# EAGLE design ATTiny1614_Mainboard (EAGLE 7.7.0)
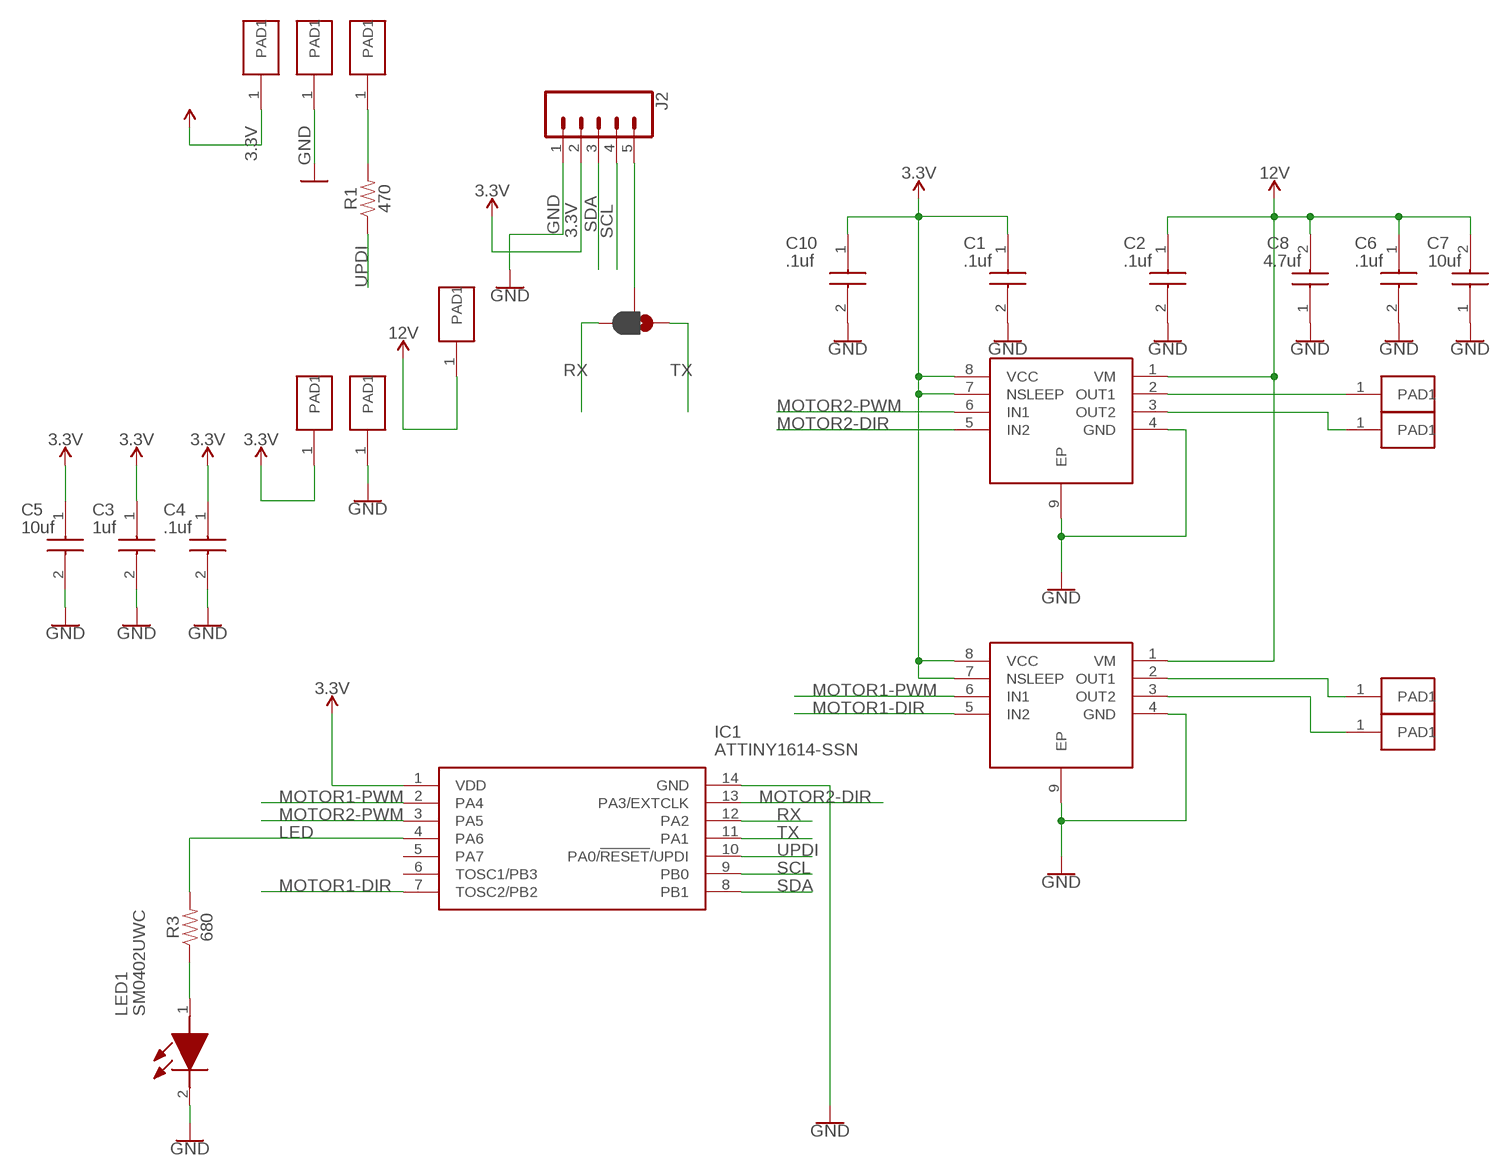
[diagram p0: schematic, sheet 1]

## Parts
C1  .1uf  0402-CAPCAPACITOR-0402  [CAPC1005X56N]
C2  .1uf  0402-CAPCAPACITOR-0402  [CAPC1005X56N]
C3  1uf  0402-CAPCAPACITOR-0402  [CAPC1005X56N]
C4  .1uf  0402-CAPCAPACITOR-0402  [CAPC1005X56N]
C5  10uf  0402-CAPCAPACITOR-0402  [CAPC1005X56N]
C6  .1uf  0402-CAPCAPACITOR-0402  [CAPC1005X56N]
C7  10uf  0402-CAPCAPACITOR-0402  [CAPC1005X56N]
C8  4.7uf  0402-CAPCAPACITOR-0402  [CAPC1005X56N]
C10  .1uf  0402-CAPCAPACITOR-0402  [CAPC1005X56N]
IC1  ATTINY1614-SSN  [SOIC127P600X175-14N]
IC2  DRV8837DSGR  [SON50P200X200X80-9N]
IC3  DRV8837DSGR  [SON50P200X200X80-9N]
J2  CONN_051.27MM  [1X05_1.27MM]
JP1  JUMPER-SMT_3_1-NC_PASTE_NO-SILK  [SMT-JUMPER_3_1-NC_PASTE_NO-SILK]
LED1  SM0402UWC  [SM0402UWC]
R1  470  470OHM-0402-1/16W-5%  [0402]
R3  680  470OHM-0402-1/16W-5%  [0402]
U$1  SINGLE_1.27MM_HOLE  [1.27MM_SINGLE_HOLE]
U$2  SINGLE_1.27MM_HOLE  [1.27MM_SINGLE_HOLE]
U$3  SINGLE_1.27MM_HOLE  [1.27MM_SINGLE_HOLE]
U$4  SINGLE_1.27MM_HOLE  [1.27MM_SINGLE_HOLE]
U$5  SINGLE_1.27MM_HOLE  [1.27MM_SINGLE_HOLE]
U$6  SINGLE_1.27MM_HOLE  [1.27MM_SINGLE_HOLE]
U$7  SINGLE_1.27MM_HOLE  [1.27MM_SINGLE_HOLE]
U$8  SINGLE_1.27MM_HOLE  [1.27MM_SINGLE_HOLE]
U$9  SINGLE_1.27MM_HOLE  [1.27MM_SINGLE_HOLE]
U$12  SINGLE_1.27MM_HOLE  [1.27MM_SINGLE_HOLE]

## Nets
3.3V: C1.1 C3.1 C4.1 C5.1 C10.1 IC1.1(VDD) IC2.7(NSLEEP) IC2.8(VCC) IC3.7(NSLEEP) IC3.8(VCC) J2.2 U$1.1(PAD1) U$4.1(PAD1)
12V: C2.1 C6.1 C7.2 C8.2 IC2.1(VM) IC3.1(VM) U$12.1(PAD1)
GND: C1.2 C2.2 C3.2 C4.2 C5.2 C6.2 C7.1 C8.1 C10.2 IC1.14(GND) IC2.4(GND) IC2.9(EP) IC3.4(GND) IC3.9(EP) J2.1 LED1.2(K) U$2.1(PAD1) U$3.1(PAD1)
LED: IC1.4(PA6) R3.2
MOTOR1-DIR: IC1.7(TOSC2/PB2) IC2.5(IN2)
MOTOR1-PWM: IC1.2(PA4) IC2.6(IN1)
MOTOR2-DIR: IC1.13(PA3/EXTCLK) IC3.5(IN2)
MOTOR2-PWM: IC1.3(PA5) IC3.6(IN1)
N$1: IC2.2(OUT1) U$8.1(PAD1)
N$2: IC2.3(OUT2) U$9.1(PAD1)
N$3: IC3.2(OUT1) U$6.1(PAD1)
N$4: IC3.3(OUT2) U$7.1(PAD1)
N$6: LED1.1(A) R3.1
N$7: J2.5 JP1.2
N$8: R1.2 U$5.1(PAD1)
RX: IC1.12(PA2) JP1.3
SCL: IC1.9(PB0) J2.4
SDA: IC1.8(PB1) J2.3
TX: IC1.11(PA1) JP1.1
UPDI: IC1.10(PA0/!RESET!/UPDI) R1.1
Unconnected: IC1.5(PA7) IC1.6(TOSC1/PB3)

## Library data of the parts
C1-C8 C10 = CJz_Master_Eaglez_Library:0402-CAP: Multilayer Ceramic Capacitors MLCC - SMD/SMT 6.3V 1uF X7R 0402 10% Tol Source: Datasheet; DESCRIPTION: Multilayer Ceramic Capacitors MLCC - SMD/SMT 6.3V 1uF X7R 0402 10% Tol; HEIGHT: 0.56mm; MANUFACTURER_NAME: AVX; MANUFACTURER_PART_NUMBER: 04026C105KAT2A; MOUSER_PART_NUMBER: 581-04026C105KAT2A; MOUSER_PRICE-STOCK: https://www.mouser.co.uk/ProductDetail/AVX/04026C105KAT2A?qs=vNaUhps%252BC9%252B%252BBkS0SDtwiQ%3D%3D
IC1 = ATTINY1614-SSN:ATTINY1614-SSN: 8-bit Microcontrollers - MCU 20MHz, SOIC, 85C, Green Source: Datasheet <https://4donline.ihs.com/images/VipMasterIC/IC/MCHP/MCHP-S-A0003038535/MCHP-S-A0003038535-1.pdf?hkey=6D3A4C79FDBF58556ACFDE234799DDF0>; DESCRIPTION: 8-bit Microcontrollers - MCU 20MHz, SOIC, 85C, Green; HEIGHT: 1.75mm; MANUFACTURER_NAME: Microchip; MANUFACTURER_PART_NUMBER: ATTINY1614-SSN; MOUSER_PART_NUMBER: 556-ATTINY1614-SSN; MOUSER_PRICE-STOCK: https://www.mouser.co.uk/ProductDetail/Microchip-Technology-Atmel/ATTINY1614-SSN?qs=T3oQrply3y%2FF20EnX%252BXRaw%3D%3D
IC2 IC3 = DRV8837DSGR:DRV8837DSGR: 1.8A Low Voltage Brushed DC Motor Driver (PWM Ctrl) Source: Datasheet <http://www.ti.com/lit/gpn/drv8837>; DESCRIPTION: 1.8A Low Voltage Brushed DC Motor Driver (PWM Ctrl); HEIGHT: 0.8mm; MANUFACTURER_NAME: Texas Instruments; MANUFACTURER_PART_NUMBER: DRV8837DSGR; MOUSER_PART_NUMBER: 595-DRV8837DSGR; MOUSER_PRICE-STOCK: https://www.mouser.co.uk/ProductDetail/Texas-Instruments/DRV8837DSGR?qs=l6ZoeTYLMwO0pKIJ8222Ww%3D%3D
J2 = MCXI_master_lib:CONN_05: Multi connection point. Often used as Generic Header-pin footprint for 0.1 inch spaced/style header connections On any of the 0.1 inch spaced packages, you can populate with these: Break Away Headers - Straight <https://www.sparkfun.com/products/116> (PRT-00116) Break Away Male Headers - Right Angle <https://www.sparkfun.com/products/553> (PRT-00553) Female Headers <https://www.sparkfun.com/products/115> (PRT-00115) Break Away Headers - Machine Pin <https://www.sparkfun.com/products/117> (PRT-00117) Break Away Female Headers - Swiss Machine Pin <https://www.sparkfun.com/products/743> (PRT-00743) For SCREWTERMINALS and SPRING TERMINALS visit here: Screw Terimnals on SparkFun.com <https://www.sparkfun.com/search/results?term=Screw+Terminals> (5mm/3.5mm/2.54mm spacing) This device is also useful as a general connection point to wire up your design to another part of your project. Our various solder wires solder well into these plated through hole pads. Hook-Up Wire - Assortment (Stranded, 22 AWG) <https://www.sparkfun.com/products/11375> (PRT-11375) Hook-Up Wire - Assortment (Solid Core, 22 AWG) <https://www.sparkfun.com/products/11367> (PRT-11367) View the entire wire category on our website here <https://www.sparkfun.com/categories/141> Special notes: Molex polarized connector foot print use with SKU : PRT-08231 with associated crimp pins and housings. 1MM SMD Version SKU: PRT-10208
JP1 = SparkFun-Jumpers:JUMPER-SMT_3_1-NC_PASTE: Normally closed solder jumper (1 of 2 connections) This jumper has an aperture in the stencil to allow solder paste to bridge one of the two connections. One connection is normally closed (NC), while the other is normally open (NO). Wick off the solder to open the connection. Reapply solder to reclose the connection. Apply solder to the other side instead to change the current path.
LED1 = led_0402:SM0402UWC: Standard LEDs - SMD SMD LED 0402 Cool White 600mcd Source: Datasheet; DESCRIPTION: Standard LEDs - SMD SMD LED 0402 Cool White 600mcd; HEIGHT: mm; MANUFACTURER_NAME: Bivar; MANUFACTURER_PART_NUMBER: SM0402UWC; MOUSER_PART_NUMBER: 749-SM0402UWC; MOUSER_PRICE-STOCK: https://www.mouser.co.uk/ProductDetail/Bivar/SM0402UWC?qs=AQlKX63v8RtLBM7E91sG3w%3D%3D
R1 = SparkFun-Resistors:470OHM: 470Ω resistor A resistor is a passive two-terminal electrical component that implements electrical resistance as a circuit element. Resistors act to reduce current flow, and, at the same time, act to lower voltage levels within circuits. - Wikipedia; PROD_ID: RES-13829
R3 = SparkFun-Resistors:470OHM: 470Ω resistor A resistor is a passive two-terminal electrical component that implements electrical resistance as a circuit element. Resistors act to reduce current flow, and, at the same time, act to lower voltage levels within circuits. - Wikipedia; PROD_ID: RES-13829; VALUE: 470
U$1-U$9 U$12 = MCXI_master_lib:SINGLE_1.27MM_HOLE

## Board
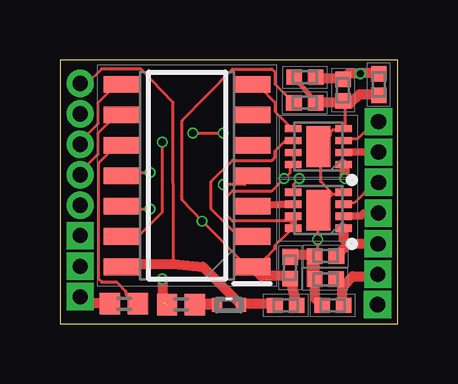
[diagram p1: board, top side]
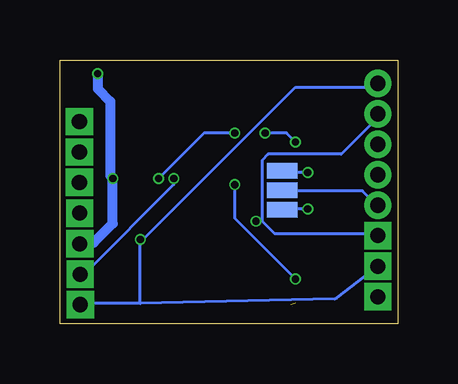
[diagram p2: board, bottom side, seen from below]

Size 14.1 x 11 mm. Coordinates in mm from the lower left corner, seen from the top.
Outline: 0,11 0,0 14.09,0 14.1,11 0,11
Copper layers (1*16): Top 0.035mm / dielectric 1.6mm / Bottom 0.035mm
Design rules "jlcpcb-2layers": minimum track width 5mil, minimum drill 0.3mm, track to track 5mil, track to pad 5mil, pad to pad 5mil, via to via 5mil, smd to smd 5mil, copper to edge 0.2mm, drill to drill 6mil, minimum pad ring 10mil, minimum via ring 3mil, stop-mask expansion 4mil, vias tented up to drill 0mil, thermal gap 10mil

### Footprints (pad centres in the part's own frame; a part is rotated, then mirrored left to right if it is on the bottom)
CAPC1005X56N = smd 0.65 x 0.64: 1 -0.45,0; 2 0.45,0
SOIC127P600X175-14N = smd 1.525 x 0.7: 1 -2.712,3.81; 2 -2.712,2.54; 3 -2.712,1.27; 4 -2.712,0; 5 -2.712,-1.27; 6 -2.712,-2.54; 7 -2.712,-3.81; 8 2.712,-3.81; 9 2.712,-2.54; 10 2.712,-1.27; 11 2.712,0; 12 2.712,1.27; 13 2.712,2.54; 14 2.712,3.81
SON50P200X200X80-9N = smd 0.7 x 0.3: 1 -1.05,0.75; 2 -1.05,0.25; 3 -1.05,-0.25; 4 -1.05,-0.75; 5 1.05,-0.75; 6 1.05,-0.25; 7 1.05,0.25; 8 1.05,0.75 | smd 1 x 1.7: 9 0,0
1X05_1.27MM = drill 0.63 pad 1: 1 0,0; 2 1.27,0; 3 2.54,0; 4 3.81,0; 5 5.08,0
SMT-JUMPER_3_1-NC_PASTE_NO-SILK = smd 0.635 x 1.27: 1 -0.813,0; 2 0,0; 3 0.813,0
SM0402UWC = smd 0.6 x 0.4: 1 0,0.5; 2 0,-0.5
0402 = smd 0.85 x 0.9: 1 -0.58,0; 2 0.58,0
1.27MM_SINGLE_HOLE = drill 0.63 pad 0.9 square: 1 0,0

### Placement (x,y rotation side)
C1  11.38,0.76 180 top
C2  10.22,10.28 180 top
C3  11.07,1.85 180 top
C4  9.6,2.33 90 top
C5  9.42,0.76 180 top
C6  11.08,2.82 180 top
C7  11.81,9.74 90 top
C8  13.3,9.97 90 top
C10  10.21,9.21 0 top
IC1  5.3,6.17 180 top
IC2  10.78,7.39 180 top
IC3  10.78,4.73 180 top
J2  0.84,10.02 270 top
JP1  4.83,5.56 270 bottom
LED1  7.05,0.78 90 top
R1  2.67,0.83 180 top
R3  5.05,0.8 180 top
U$1  0.84,3.67 0 top
U$2  0.84,2.39 0 top
U$3  13.25,0.79 0 top
U$4  13.26,2.06 0 top
U$5  0.84,1.12 0 top
U$6  13.28,4.61 0 top
U$7  13.29,5.89 0 top
U$8  13.29,7.16 0 top
U$9  13.29,8.43 0 top
U$12  13.27,3.33 0 top

### Tracks (layer width: path | path; a pad name or v marks a point on that pad's centre or on a via)
3.3V  (via drill 0.3)
  Top 0.127: 11.76,0.84 C1.1 | 13.03,1.98 U$4.1 | 9.79,1.1 9.86,0.84 C5.1 | 9.61,1.86 C4.1 9.48,1.98 | IC2.7 9.73,7.06 9.73,6.68 IC2.8 9.61,6.56 9.61,6.3 v9.35,6.05 8.84,5.54 7.19,5.54 6.94,5.29 6.94,4.53 7.19,4.27 9.73,4.27 9.73,4.4 IC3.7 | 9.73,4.02 IC3.8 9.61,3.89 8.97,3.26 8.97,3.13 8.59,2.75 | C10.1 9.73,9.22 8.97,9.99 8.97,10.49 8.84,10.62 7.19,10.62 5.1,8.46 5.1,5.16 v5.92,4.27 7.95,2.24 IC1.1 8.08,2.24 8.59,2.75 | 8.59,2.75 8.72,2.75 | 11.64,1.73 11.76,1.6 C3.1 11.64,1.73
  Top 0.305: 9.73,4.27 IC3.8
  Top 0.406: U$4.1 13.17,1.97 12.2,1.97 11.83,1.6 11.76,1.6 11.76,0.83 C1.1 | 9.79,1.1 C4.1 | 9.48,1.98 8.39,1.98 IC1.1
  Bottom 0.127: 5.67,4.27 5.16,3.76 0.84,3.76 U$1.1 | 5.67,4.27 5.67,6.81 5.41,7.06 2.37,7.06 0.84,8.59 J2.2 | v9.35,6.05 9.35,5.79 13.03,2.11 U$4.1 | v5.92,4.27 5.67,4.27
12V  (via drill 0.3)
  Top 0.127: 11.64,2.87 C6.1 | 11.76,10.24 C7.2 11.89,10.11 12.05,10.21 | 10.75,10.24 C2.1 | 11.89,6.56 IC2.1
  Top 0.203: v12.53,10.43 | 13.28,10.44 C8.2
  Top 0.406: 10.75,10.24 11.76,10.24 C7.2 12.05,10.43 v12.53,10.43 v12.53,10.44 13.28,10.44 | U$12.1 12.04,3.33 | 12.04,3.33 C6.1 | 12.04,3.33 11.87,3.48 11.83,3.52 IC3.1 | v11.89,6.05 11.89,6.58 IC2.1
  Bottom 0.127: 13.03,3.38 U$12.1
  Bottom 0.406: 13.03,3.38 12.69,3.38 11.9,4.17 v11.9,6.04 v11.89,6.05 12,6.16 12,9.27 12.53,9.8 v12.53,10.43
GND  (via drill 0.3)
  Top 0.127: 7.57,0.84 LED1.2 7.45,0.84 | 8.97,0.84 C5.2 | 2.63,2.5 IC1.14 | 4.74,2.5 4.73,9.22 3.38,10.62 1.73,10.62 1.1,9.99 0.84,9.99 J2.1 | 11.76,9.22 C7.1 11.89,9.22 11.89,8.21 IC2.4 11.76,8.08 11.38,8.08 11.26,7.95 11.26,7.83 10.88,7.45 IC2.9 10.88,7.32 10.88,5.92 11.38,5.41 | 9.86,10.24 C2.2 | 10.75,9.22 C10.2 | 9.61,2.75 C4.2 | 10.88,0.84 C1.2 | 10.62,1.73 C3.2 10.62,2.75 C6.2 10.75,2.87 v10.75,3.51 10.75,4.65 IC3.9 10.75,4.78 11.38,5.41 | 11.38,5.41 11.76,5.41 IC3.4
  Top 0.203: 12.03,9.17 C7.1 | 9.86,10.24 9.94,10.08 C10.2
  Top 0.406: 11.76,9.22 10.67,9.22 C10.2 | 12.03,9.17 12.1,9.17 12.5,9.57 13.25,9.57 C8.1 | 10.62,2.75 10.62,1.89 10.5,1.77 10.5,2.77 10.6,2.87 9.69,2.87 C4.2 | 10.62,1.73 10.62,1.07 C1.2 | 7.57,0.84 8.89,0.84 C5.2 | 2.63,2.5 4.74,2.5 5.96,2.37 LED1.2
  Bottom 0.127: 10.75,0.84 2.64,1.02 2.55,1.08 U$2.1 | 10.75,0.84 13.03,0.84 U$3.1 | 10.75,0.84 10.75,3.38 | 10.75,3.38 4.27,9.86 0.84,9.86 J2.1 | 10.75,3.38 v10.75,3.51
LED  (via drill 0.3)  (1 unrouted)
  Top 0.127: v6.81,5.79 7.7,5.79 7.95,6.05 IC1.4
  Top 0.406: v4.27,1.86 4.27,0.86
  Bottom 0.127: v4.27,1.86 6.81,4.4 v6.81,5.79
MOTOR1-DIR
  Top 0.127: IC2.5 9.61,8.21 8.97,8.84 8.97,9.22 8.34,9.86 8.08,9.86 IC1.7
MOTOR1-PWM
  Top 0.127: IC2.6 9.61,7.57 9.35,7.57 8.97,7.19 8.97,6.94 8.84,6.81 7.19,6.81 6.3,5.92 6.3,4.78 7.45,3.64 7.95,3.64 IC1.2
MOTOR2-DIR  (via drill 0.3)
  Top 0.127: v9.99,6.05 9.73,5.79 9.73,5.54 IC3.5 | v5.54,7.95 v6.81,7.95 | v4.27,7.57 4.27,4.65 3.26,3.64 2.62,3.64 IC1.13
  Bottom 0.127: v9.99,6.05 8.08,7.95 v6.81,7.95 | v5.54,7.95 4.65,7.95 v4.27,7.57
MOTOR2-PWM
  Top 0.127: 9.6,4.99 IC3.6 | 8.08,4.91 IC1.3
  Top 0.305: 9.6,4.99 IC1.3
N$1
  Top 0.127: 11.89,7.19 IC2.2
  Top 0.305: U$8.1 11.85,7.16 IC2.2
N$2
  Top 0.127: IC2.3 11.89,7.7 12.4,7.7 13.03,8.33 U$9.1
N$3
  Top 0.305: U$6.1 12.68,4.61 12.55,4.48 IC3.2
N$4
  Top 0.127: IC3.3 11.89,5.03 12.27,5.03 13.03,5.79 U$7.1
N$6
  Top 0.127: 6.43,0.84 LED1.1
  Top 0.406: 6.14,0.84 6.49,0.84 LED1.1 6.55,0.8 R3.1
N$7
  Bottom 0.127: JP1.2 4.78,5.54 1.48,5.54 0.84,4.91 J2.5
N$8
  Top 0.127: 1.99,0.84 R1.2 | 0.84,1.1 U$5.1
  Top 0.406: 1.99,0.84 1.12,0.84 U$5.1
RX  (via drill 0.3)
  Top 0.127: v3.76,4.78 2.62,4.78 IC1.12
  Bottom 0.127: v3.76,4.78 4.78,4.78 JP1.3
SCL
  Top 0.127: IC1.9 2.49,8.59 2.24,8.59 1.6,7.95 1.6,7.06 0.71,6.18 J2.4
SDA
  Top 0.127: IC1.8 2.49,9.86 2.24,9.86 1.6,9.22 1.6,8.33 0.71,7.45 J2.3
TX  (via drill 0.3)
  Top 0.127: v3.76,6.3 2.75,6.3 2.62,6.18 IC1.11
  Bottom 0.127: v3.76,6.3 4.78,6.3 JP1.1
UPDI
  Top 0.127: R1.1 3.13,0.84 2.75,1.22 2.75,1.35 2.37,1.73 1.73,1.73 1.6,1.86 1.6,6.68 2.24,7.32 2.49,7.32 IC1.10